# EAGLE design Haar_Primal_HardMount (EAGLE 9.6.2)
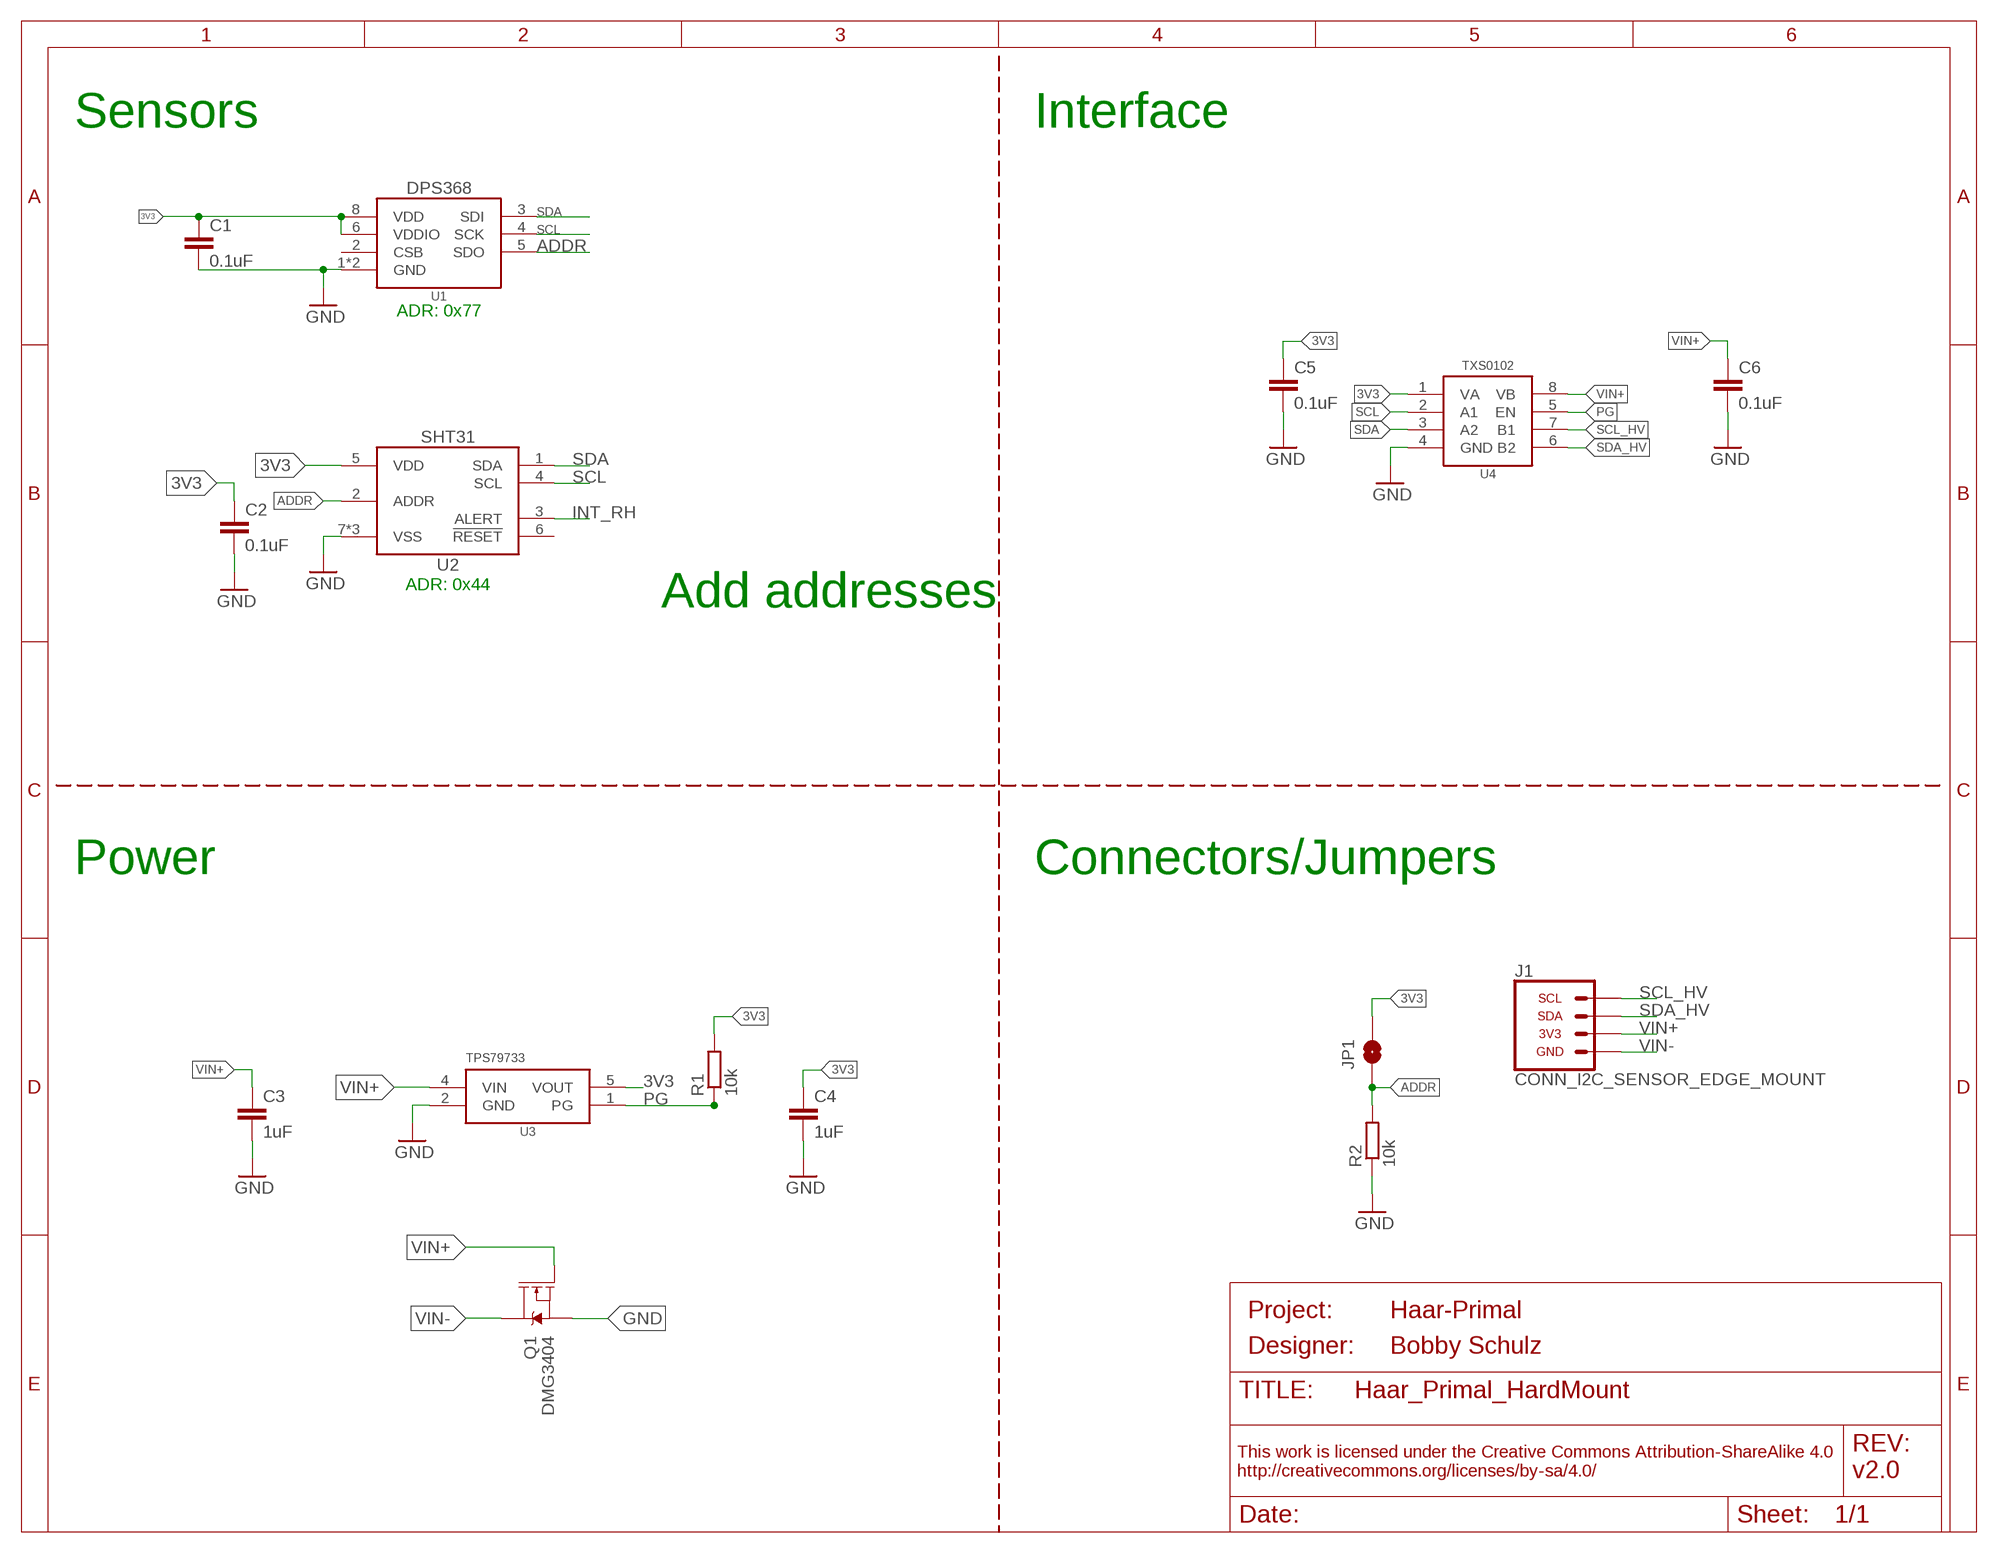
[diagram p0: schematic, sheet 1]
FRAME1 (FRAME_A_L): DESIGNER: Bobby Schulz; PROJECT: Haar-Primal; REV: v2.0

## Parts
C1  0.1uF  C-EU0.1UFC0603  [C0603]
C2  0.1uF  C-EU0.1UFC0603  [C0603]
C3  1uF  C-EU1UFC0603  [C0603]
C4  1uF  C-EU1UFC0603  [C0603]
C5  0.1uF  C-EU0.1UFC0603  [C0603]
C6  0.1uF  C-EU0.1UFC0603  [C0603]
J1  CONN_I2C_SENSOR_EDGE_MOUNT  [SOLDERCUP_CONN_QUAD]
JP1  JUMPER-SMT_2_NO_SILK  [SMT-JUMPER_2_NO_SILK]
Q1  DMG3404  MOSFET-NCH-DMG3404L  [SOT23-3]
R1  10k  R-EU_100KR0603  [R0603]
R2  10k  R-EU_100KR0603  [R0603]
U1  DPS368  [PG-VLGA-8]
U2  SHT31DFN  [DFN_8_2.5X2.5]
U3  TPS79733  [DCK_R-PDSO-G5]
U4  TXS0102DQM  [DQM_R-PX2SON-N8]

## Nets
3V3: C1.1 C2.1 C4.1 C5.1 JP1.2 R1.2 U1.6(VDDIO) U1.8(VDD) U2.5(VDD) U3.5(VOUT) U4.1(VA)
ADDR: JP1.1 R2.2 U1.5(SDO) U2.2(ADDR)
GND: C1.2 C2.2 C3.2 C4.2 C5.2 C6.2 Q1.2(S) R2.1 U1.1(GND) U1.7(GND) U2.7(VSS) U2.8(VSS) U2.EP(VSS) U3.2(GND) U4.4(GND)
INT_RH: U2.3(ALERT)
PG: R1.1 U3.1(PG) U4.5(EN)
SCL: U1.4(SCK) U2.4(SCL) U4.2(A1)
SCL_HV: J1.3(SCL) U4.7(B1)
SDA: U1.3(SDI) U2.1(SDA) U4.3(A2)
SDA_HV: J1.1(SDA) U4.6(B2)
VIN+: C3.1 C6.1 J1.2(3V3) Q1.1(G) U3.4(VIN) U4.8(VB)
VIN-: J1.4(GND) Q1.3(D)
Unconnected: U1.2(CSB) U2.6(!RESET)

## Notes on the sheet
- Sensors | Interface
- ADR: 0x77
- ADR: 0x44
- Add addresses
- Power | Connectors/Jumpers

## Library data of the parts
C1 C2 C5 C6 = bschulz_passives:C-EU: CAPACITOR, European symbol; DIGIKEY: 490-6051-1-ND; MF: Murata; MPN: GCM188R71E104KA57D
C3 C4 = bschulz_passives:C-EU: CAPACITOR, European symbol; DIGIKEY: 587-1251-1-ND; MF: Yaiyo Yuden; MPN: EMK107BJ105KA-T
J1 = GEMS_Plugs:CONN_I2C_SENSOR: GEMS Connector for I2C Devices - Sensor Side; DIGIKEY: A97650-ND; MF: TE Connectivity; MPN: 1838893-2
JP1 = bschulz:JUMPER-SMT_2_NO: Normally open jumper This jumper has two pads in close proximity to each other. Apply solder to close the connection. Round pads are easier to solder for beginners, but are a lot larger. SparkFun Product that uses the round pads: SparkFun EL Sequencer <https://www.sparkfun.com/products/12781>; DIGIKEY: DNP; MF: N/A; MPN: N/A
Q1 = bschulz:MOSFET-NCH: N-channel MOSFETs Voltage controlled devices that allow control of high current outputs. SparkFun Products: SparkFun OpenScale <https://www.sparkfun.com/products/13261> SparkFun Digital Sandbox <https://www.sparkfun.com/products/12651> SparkFun Monster Moto Shield <https://www.sparkfun.com/products/10182> SparkFun MOSFET Power Controller <https://www.sparkfun.com/products/11214>; DIGIKEY: DMG3404L-7DICT-ND; MF: Diodes Incorporated; MPN: DMG3404L-7
R1 R2 = bschulz_passives:R-EU_: RESISTOR, European symbol Digikey Parts: Yageo, 0402 <https://www.digikey.com/products/en/resistors/chip-resistor-surface-mount/52?k=&pkeyword=&sv=0&s=4356&sf=1&FV=-1%7C13%2C7%7C2%2C1291%7C39157%2C1989%7C0%2C-8%7C52%2C3%7C1131%2C3%7C2503&quantity=&ColumnSort=0&page=1&stock=1&pageSize=25> Yageo, 0603 <https://www.digikey.com/products/en/resistors/chip-resistor-surface-mount/52?k=&pkeyword=&sv=0&pv1291=39245&sf=1&FV=-5%7C4356%2C-5%7C47360%2C-8%7C52%2C-1%7C13%2C7%7C2%2C1989%7C0&quantity=10&ColumnSort=1000011&page=1&stock=1&pageSize=25> Panasonic, 0603 <https://www.digikey.com/products/en/resistors/chip-resistor-surface-mount/52?k=&pkeyword=&pv252=68&sf=0&FV=ffec373d%2C1c0002%2C142c040c%2C1f140000%2Cffe00034%2C80002%2Cc0001&quantity=&ColumnSort=0&page=1&stock=1&pageSize=25> Panasonic, precision, 0603 <https://www.digikey.com/products/en/resistors/chip-resistor-surface-mount/52?FV=ffec4907%2Cfffc000a%2Cc0172%2C142c040c%2C1f140000%2Cffe00034%2C1c0002&quantity=100&ColumnSort=2085&page=1&stock=1&pageSize=25> Panasonic, 0805 <https://www.digikey.com/products/en/resistors/chip-resistor-surface-mount/52?k=&pkeyword=&pv3=1&sf=0&FV=ffec373d%2C1c0002%2C1f140000%2Cffe00034%2C142c040d&quantity=&ColumnSort=0&page=1&stock=1&pageSize=25> Rohm, current sense <https://www.digikey.com/products/en/resistors/chip-resistor-surface-mount/52?k=&pkeyword=&pv3=1&sf=0&FV=ffecb688%2C1f140000%2Cffe00034%2C1c0002&quantity=&ColumnSort=0&page=1&stock=1&pageSize=25> Vishay, pulse proof automotive <https://www.digikey.com/products/en/resistors/chip-resistor-surface-mount/52?k=&pkeyword=&pv7=2&sf=0&FV=ffec5d6b%2Cffe00034%2C1f140000&quantity=&ColumnSort=0&page=1&stock=1&pageSize=25>; DIGIKEY: 311-100KHRCT-ND; MF: Yageo; MPN: RC0603FR-07100KL; VALUE_PART: 100k
U1 = bschulz:DPS368: DPS368 - Digital Pressure Sensor Characteristics: Vcc: 1.7V ~ 3.6V Pressure Range: 300 ~ 1200 mBar Pressure Resolution: 0.002 mBar, max Pressure Accuracy: relative ±0.06 mBar, abs ± 1 mBar Temperature Resolution: 0.01°C Temperature Accuracy: 0.5°C Operating Temperature: -40°C to 85°C Digikey: DPS368XTSA1CT-ND <https://www.digikey.com/product-detail/en/DPS368XTSA1/DPS368XTSA1CT-ND/10244081/?itemSeq=300835075>; DIGIKEY: DPS368XTSA1CT-ND; DISP: DPS368; MF: Infineon; MPN: DPS368XTSA1
U2 = bschulz:SHT3*: SHT3x - Digital Humidity and Temperature Sensor Characteristics (for SHT35): Vcc: 2.15V ~ 5.5V Humidity Resolution: 0.01% RH Humidity Accuracy: ±1.5% RH Temperature Resolution: 0.01°C Temperature Accuracy: 0.1°C Operating Temperature: -40°C to 125°C Digikey: 1649-1065-1-ND (SHT30) <https://www.digikey.com/product-detail/en/sensirion-ag/SHT30-DIS-F2.5KS/1649-1065-1-ND/6212136> 1649-1066-1-ND (SHT31) <https://www.digikey.com/product-detail/en/sensirion-ag/SHT31-DIS-F2.5KS/1649-1066-1-ND/6212137> 1649-1067-1-ND (SHT35) <https://www.digikey.com/product-detail/en/sensirion-ag/SHT35-DIS-F2.5KS/1649-1067-1-ND/6212138>; DIGIKEY: 1649-1066-1-ND; DISP: SHT31; MF: Sensirion; MPN: SHT31-DIS-F2.5KS
U3 = bschulz:TPS797*: TPS797* - Ultra Low Power Low Dropout Linear Regulator Characteristics: Vin: 1.4V ~ 5.5V Vout: 1.8, 2.85, 3.0, 3.3V fixed IQ: 1.2μA typ, 2μA max Voltage Accuracy: 4% max Dropout Voltage: 105mV @ 10mA Output Current: 50 mA Operating Temperature: -40°C to 85°C Digikey: TPS79733 (3.3V Fixed) <https://www.digikey.com/product-detail/en/texas-instruments/TPS79733DCKR/296-11990-1-ND/390520> TPS79730 (3.0V Fixed) <https://www.digikey.com/product-detail/en/texas-instruments/TPS79730DCKR/296-11989-1-ND/390518> TPS797285 (2.85V Fixed) <https://www.digikey.com/product-detail/en/texas-instruments/TPS797285DCKR/296-25465-1-ND/2187585> TPS79718 (1.8V Fixed) <https://www.digikey.com/product-detail/en/texas-instruments/TPS79718DCKR/296-11988-1-ND/390516>; DIGIKEY: 296-11990-1-ND; DISP: TPS79733; MF: TI; MPN: TPS79733DCKR
U4 = bschulz:TXS0102: TXS0102 - 2 Channel Bidirectional Voltage Level Translator Characteristics: Vcc: 1.65 ~ 3.6V (Port A), 2.3 ~ 5.5V (Port B) IQ: 14.4μA Output Current: 50mA Output Type: Open Drain/Push-Pull Operating Temperature: -40°C to 85°C Digikey: 296-28368-1-ND (DQE) <https://www.digikey.com/product-detail/en/texas-instruments/TXS0102DQER/296-28368-1-ND/2625893> 296-28435-1-ND (DQM) <https://www.digikey.com/product-detail/en/texas-instruments/TXS0102DQMR/296-28435-1-ND/2638910> 296-21931-1-ND (DCU) <https://www.digikey.com/product-detail/en/texas-instruments/TXS0102DCUR/296-21931-1-ND/1629284>; DIGIKEY: 296-28435-1-ND; MF: TI; MPN: TXS0102DQMR

## Board
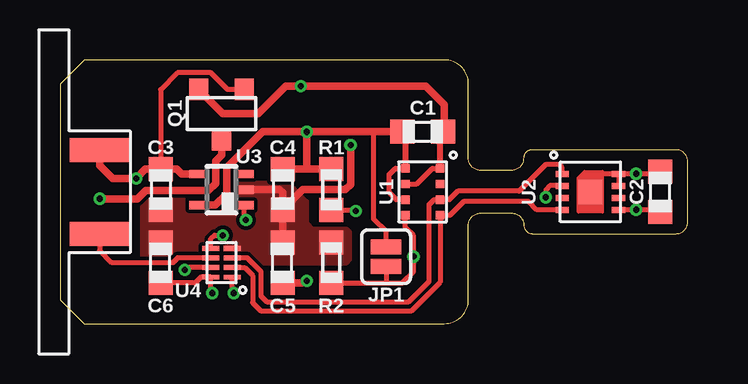
[diagram p1: board, top side]
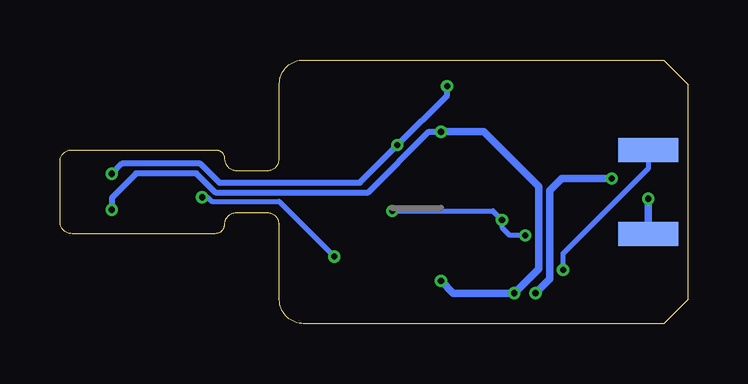
[diagram p2: board, bottom side, seen from below]

Size 26.16 x 11 mm. Coordinates in mm from the lower left corner, seen from the top.
Outline: 25.66,7.25 19.67,7.25 arc90 19.31,6.89 arc-90 18.81,6.39 17.52,6.39 arc-90 17.02,6.89 17.02,10 arc90 16.02,11 1,11 0,10 0,1 1,0 16.02,0 arc90 17.02,1 17.02,4.11 arc-90 17.52,4.61 18.82,4.61 arc-90 19.32,4.11 arc90 19.68,3.75 25.66,3.75 arc90 26.16,4.25 26.16,6.75 arc90 25.66,7.25
Copper layers (1*16): Top 0.035559375mm / dielectric 1.6mm / Bottom 0.035559375mm
Design rules "oshpark-2layer": minimum track width 6mil, minimum drill 10mil, track to track 6mil, track to pad 6mil, pad to pad 6mil, via to via 6mil, smd to smd 6mil, copper to edge 15mil, drill to drill 6mil, minimum pad ring 5mil, minimum via ring 5mil, stop-mask expansion 2.5mil, vias tented up to drill 0mil, thermal gap 10mil

### Footprints (pad centres in the part's own frame; a part is rotated, then mirrored left to right if it is on the bottom)
C0603 = smd 1 x 1: 1 -0.85,0; 2 0.85,0
SOLDERCUP_CONN_QUAD = smd 1 x 2.5: 1 1.75,1.27; 2 -1.75,1.27 | smd 1 x 2.5 bottom: 3 -1.75,1.27; 4 1.75,1.27
SMT-JUMPER_2_NO_SILK = smd 0.635 x 1.27: 1 -0.406,0; 2 0.406,0
SOT23-3 = smd 0.8 x 0.9: 1 -0.95,-1; 2 0.95,-1; 3 0,1.1
R0603 = smd 1 x 1: 1 -0.85,0; 2 0.85,0
PG-VLGA-8 = smd 0.35 x 0.35: 1 0.725,0.975; 2 0.725,0.325; 3 0.725,-0.325; 4 0.725,-0.975; 5 -0.725,-0.975; 6 -0.725,-0.325; 7 -0.725,0.325; 8 -0.725,0.975
DFN_8_2.5X2.5 = smd 0.55 x 0.25: 1 -1.175,0.75; 2 -1.175,0.25; 3 -1.175,-0.25; 4 -1.175,-0.75; 5 1.175,-0.75; 6 1.175,-0.25; 7 1.175,0.25; 8 1.175,0.75 | smd 1 x 1: EP 0,0
DCK_R-PDSO-G5 = smd 0.35 x 0.8: 1 -0.65,-0.95; 2 0,-0.95; 3 0.65,-0.95; 4 0.65,0.95; 5 -0.65,0.95
DQM_R-PX2SON-N8 = smd 0.2 x 0.7: 1 -0.6,-0.45; 2 -0.2,-0.45; 3 0.2,-0.45; 4 0.6,-0.45; 5 0.6,0.45; 6 0.2,0.45; 7 -0.2,0.45; 8 -0.6,0.45

### Placement (x,y rotation side)
C1  15.11,8 0 top
C2  25.02,5.5 90 top
C3  4.19,5.59 270 top
C4  9.27,5.59 270 top
C5  9.27,2.54 90 top
C6  4.19,2.54 90 top
J1  0.38,5.5 270 top
JP1  13.59,2.79 90 top
Q1  6.73,8.76 180 top
R1  11.3,5.59 90 top
R2  11.3,2.54 270 top
U1  15.11,5.5 0 top
U2  22.1,5.5 0 top
U3  6.73,5.59 90 top
U4  6.73,2.54 90 top

### Tracks (layer width: path | path; a pad name or v marks a point on that pad's centre or on a via)
3V3  (via drill 0.25)
  Top 0.2: C2.1 24.92,4.75 v24,4.75 U2.5 | U1.6 14,5.17 13.72,5.46 13.72,6.22 13.97,6.48 U1.8 | v7.24,1.27 7.18,1.33 U4.1 | JP1.2 13.59,3.83 13.08,4.34 13.08,8
  Top 0.254: C1.1 14.39,7.88 U1.8
  Top 0.305: v10.29,8 13.08,8 C1.1 | U3.5 6.47,4.94 6.94,5.41 6.94,6.51 8.44,8 v10.29,8 | C5.1 10.2,1.69 v10.29,1.78 | C4.1 10.29,6.44 | 10.29,6.44 R1.2 | v10.29,8 10.29,6.44
  Bottom 0.254: v24,4.75 24,5.25 22.99,6.26 20.48,6.26 19.69,5.47 13.32,5.47 10.79,8 v10.29,8
  Bottom 0.305: v10.29,8 8.51,8 6.22,5.71 6.22,2.29 v7.24,1.27 9.78,1.27 v10.29,1.78
ADDR  (via drill 0.25)
  Top 0.2: U2.2 20.42,5.75 20.24,5.58 v20.24,5.27 | R2.2 13.59,1.69 | 13.59,1.69 14.26,1.69 14.73,2.16 v14.73,2.79 14.73,3.67 14.39,4.02 U1.5 | JP1.1 13.59,1.69
  Bottom 0.2: v20.24,5.27 20.02,5.27 19.85,5.09 17.03,5.09 v14.73,2.79
GND  (via drill 0.25)
  Top 0.2: U2.EP 21.93,5.67 22.51,6.25 U2.8 | U2.8 U2.7 | C2.2 24.92,6.25 v24,6.25 U2.8 | U1.7 14.86,5.83 15.51,6.47 U1.1
  Top 0.254: U1.1 15.84,7.88 C1.2
  Top 0.305: C1.2 16,8.04 16,9.14 15.24,9.91 v10.03,9.91 9.4,9.91 8.26,8.76 6.78,8.76 Q1.2 | U3.2 9.14,5.59 9.27,5.46 C4.2 | C5.2 C4.2 | C4.2 10.12,5.59 11.88,5.59 12.11,5.81 v12.11,7.44 | v12.11,7.44
  Bottom 0.254: v24,6.25 23.59,6.67 20.31,6.67 19.52,5.88 13.67,5.88 v12.11,7.44 10.03,9.52 v10.03,9.91
  pour Top (no thermals): 3.94,5.84 3.43,5.33 3.43,2.67 3.56,2.54 11.94,2.54 12.06,2.67 12.06,3.81 11.94,3.94 10.54,3.94 10.29,4.19 10.29,5.08 9.53,5.84
PG  (via drill 0.25)
  Top 0.2: R1.1 12.28,4.74 v12.32,4.7 | v7.75,4.32 7.68,4.38 U3.1 | U4.5 6.28,3.52 6.44,3.68 v6.78,3.68
  Bottom 0.2: v12.32,4.7 8.13,4.7 v7.75,4.32 7.75,4.01 7.42,3.68 v6.78,3.68
SCL
  Top 0.2: U1.4 15.84,4.52 | 15.84,4.52 15.84,1.72 14.65,0.54 8.36,0.54 8.03,0.87 8.03,2 7.69,2.34 U4.2 | U2.4 19.86,4.75 19.52,5.09 16.82,5.09 16.24,4.52 15.84,4.52
SCL_HV  (via drill 0.25)
  Top 0.2: U4.7 5.31,2.34 v5.2,2.23
  Bottom 0.2: v5.2,2.23 5.2,2.93 1.65,6.48 J1.3
SDA
  Top 0.2: U2.1 20.92,6.5 20.8,6.63 20.23,6.63 19.13,5.53 16.58,5.53 16.22,5.17 U1.3 15.59,5.17 15.37,4.95 15.37,1.75 14.51,0.89 8.64,0.89 8.38,1.14 8.38,2.16 7.8,2.74 U4.3
SDA_HV
  Top 0.2: U4.6 4.9,2.74 4.7,2.54 2.16,2.54 1.65,3.05 J1.1
VIN+  (via drill 0.25)
  Top 0.2: C6.1 5.63,1.69 5.88,1.94 U4.8 6.28,1.34 v6.35,1.27 | Q1.1 6.99,9.76 6.29,10.46 4.89,10.46 4.19,9.76 C3.1
  Top 0.305: U3.4 5.07,6.24 4.87,6.44 C3.1 3.56,6.44 v3.17,6.06 2.2,6.06 1.65,6.6 J1.2
  Bottom 0.305: v6.35,1.27 5.76,1.86 5.76,5.54 5.25,6.06 v3.17,6.06
VIN-  (via drill 0.25)
  Top 0.305: v1.65,5.21 3.23,5.21 3.56,5.54 6.18,5.54 6.49,5.85 6.49,6.78 6.73,7.03 Q1.3
  Bottom 0.305: v1.65,5.21 J1.4

### Text on the board
Document: #2 Screw
tDocu: Project Haar | V+ | SDA | Primal / HardMount
bDocu: SCL | Vcc: 3V ~ 5V / Logic: Vcc | SHT3 | Project Haar - Primal / Hard Mount / v2.0 / Bobby Schulz - UMN/GEMS | V-